# EAGLE design SD_A2 (EAGLE 9.2.2)
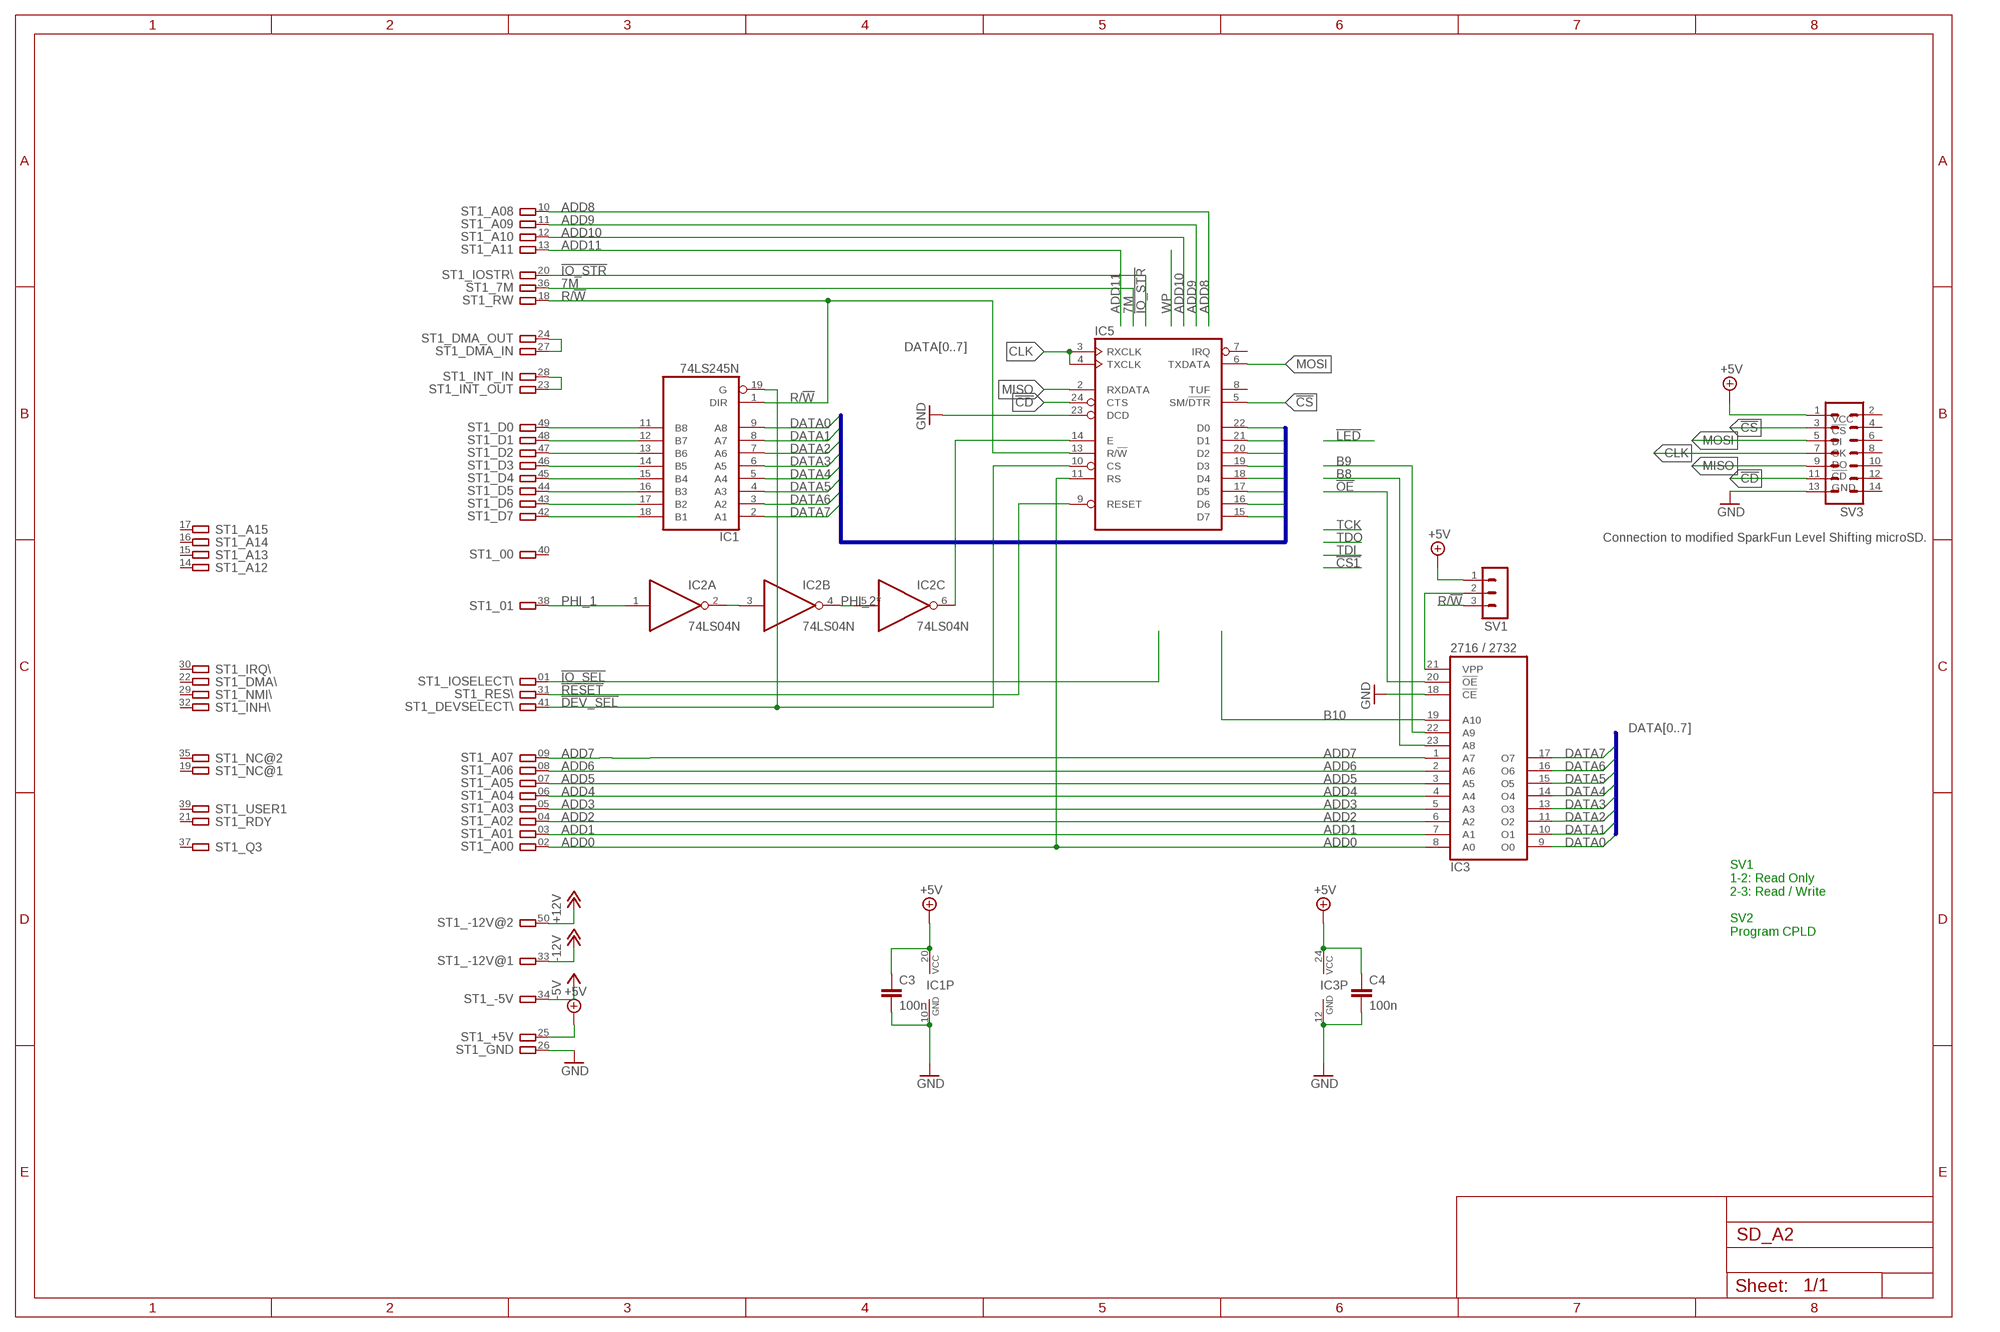
[diagram p0: schematic, sheet 1]

## Parts
C3  100n  C-EUC0603K  [C0603K]
C4  100n  C-EUC0603K  [C0603K]
IC1  74LS245N  [DIL20]
IC2  74LS04N  [DIL14]
IC3  2716 / 2732  2716  [DIL24]
IC5  6852  [DIL24]
ST1  A2-50PINSLOT1-3  [A2-50PIN-SL1-3]
SV1  MA03-1  [MA03-1]
SV3  MA07-2  [MA07-2]

## Nets
7M: ST1.36
!CD: IC5.24(CTS) SV3.11
!CS: IC5.5(SM/!DTR) SV3.3
!DEV_SEL: IC1.19(G) IC5.10(CS) ST1.41
!IO_SEL: ST1.01
!IO_STR: ST1.20
!OE: IC3.20(!OE)
!RESET: IC5.9(RESET) ST1.31
+5V: C3.1 C4.1 IC1.20(VCC) IC3.24(VCC) ST1.25 SV1.1 SV3.1
+12V: ST1.50
-5V: ST1.34
-12V: ST1.33
ADD0: IC3.8(A0) IC5.11(RS) ST1.02
ADD1: IC3.7(A1) ST1.03
ADD2: IC3.6(A2) ST1.04
ADD3: IC3.5(A3) ST1.05
ADD4: IC3.4(A4) ST1.06
ADD5: IC3.3(A5) ST1.07
ADD6: IC3.2(A6) ST1.08
ADD7: IC3.1(A7) ST1.09
ADD8: ST1.10
ADD9: ST1.11
ADD10: ST1.12
ADD11: ST1.13
B8: IC3.23(A8)
B9: IC3.22(A9)
B10: IC3.19(A10)
CLK: IC5.3(RXCLK) IC5.4(TXCLK) SV3.7
DATA0: IC1.9(A8) IC3.9(O0) IC5.22(D0)
DATA1: IC1.8(A7) IC3.10(O1) IC5.21(D1)
DATA2: IC1.7(A6) IC3.11(O2) IC5.20(D2)
DATA3: IC1.6(A5) IC3.13(O3) IC5.19(D3)
DATA4: IC1.5(A4) IC3.14(O4) IC5.18(D4)
DATA5: IC1.4(A3) IC3.15(O5) IC5.17(D5)
DATA6: IC1.3(A2) IC3.16(O6) IC5.16(D6)
DATA7: IC1.2(A1) IC3.17(O7) IC5.15(D7)
GND: C3.2 C4.2 IC1.10(GND) IC3.12(GND) IC3.18(!CE) IC5.23(DCD) ST1.26 SV3.13
MISO: IC5.2(RXDATA) SV3.9
MOSI: IC5.6(TXDATA) SV3.5
N$1: IC2.2(A:O) IC2.3(B:I)
N$2: IC2.4(B:O) IC2.5(C:I)
N$5: ST1.24 ST1.27
N$6: ST1.23 ST1.28
N$7: IC1.11(B8) ST1.49
N$8: IC1.18(B1) ST1.42
N$10: IC1.17(B2) ST1.43
N$11: IC1.16(B3) ST1.44
N$14: IC1.15(B4) ST1.45
N$15: IC1.14(B5) ST1.46
N$16: IC1.13(B6) ST1.47
N$17: IC1.12(B7) ST1.48
PHI_1: IC2.1(A:I) ST1.38
PHI_2*: IC2.6(C:O) IC5.14(E)
R/!W: IC1.1(DIR) IC5.13(R/!W) ST1.18 SV1.3
VPP: IC3.21(VPP) SV1.2
Unconnected: IC2.8(D:O) IC2.9(D:I) IC2.10(E:O) IC2.11(E:I) IC2.12(F:O) IC2.13(F:I) IC5.7(IRQ) IC5.8(TUF) ST1.14 ST1.15 ST1.16 ST1.17 ST1.19 ST1.21 ST1.22 ST1.29 ST1.30 ST1.32 ST1.35 ST1.37 ST1.39 ST1.40 SV3.2 SV3.4 SV3.6 SV3.8 SV3.10 SV3.12 SV3.14

## Buses
DATA[0..7]

## Notes on the sheet
- VCC
  !CS
  DI
  CK
  DO
  !CD
  GND
- Connection to modified SparkFun Level Shifting microSD.
- SV1
  1-2: Read Only
  2-3: Read / Write
  
  SV2
  Program CPLD

## Power pins joined to a net without a drawn wire
GND: IC2.7(P:GND)
VCC: IC2.14(P:VCC) IC5.12(VCC)
VSS: IC5.1(VSS)

## Library data of the parts
C3 C4 = rcl:C-EU: CAPACITOR, European symbol
IC1 = 74xx-eu:74*245: Octal BUS TRANSCEIVER, 3-state
IC2 = 74xx-us:74*04: Hex INVERTER
IC3 = memory:2716: MEMORY
IC5 = micro-motorola:6852: MICROCONTROLLER/MEMORY DEVICE; OC_FARNELL: unknown; OC_NEWARK: unknown
ST1 = con-apple2:A2-50PIN: Apple ][ Peripheral Card Connector This is the, default, 50-pin connector for slot #1 to #7 Pins are laid out as seen from the top of the slot
SV1 = con-lstb:MA03-1: PIN HEADER; OC_FARNELL: unknown; OC_NEWARK: unknown
SV3 = con-lstb:MA07-2: PIN HEADER; OC_FARNELL: unknown; OC_NEWARK: unknown

## Board
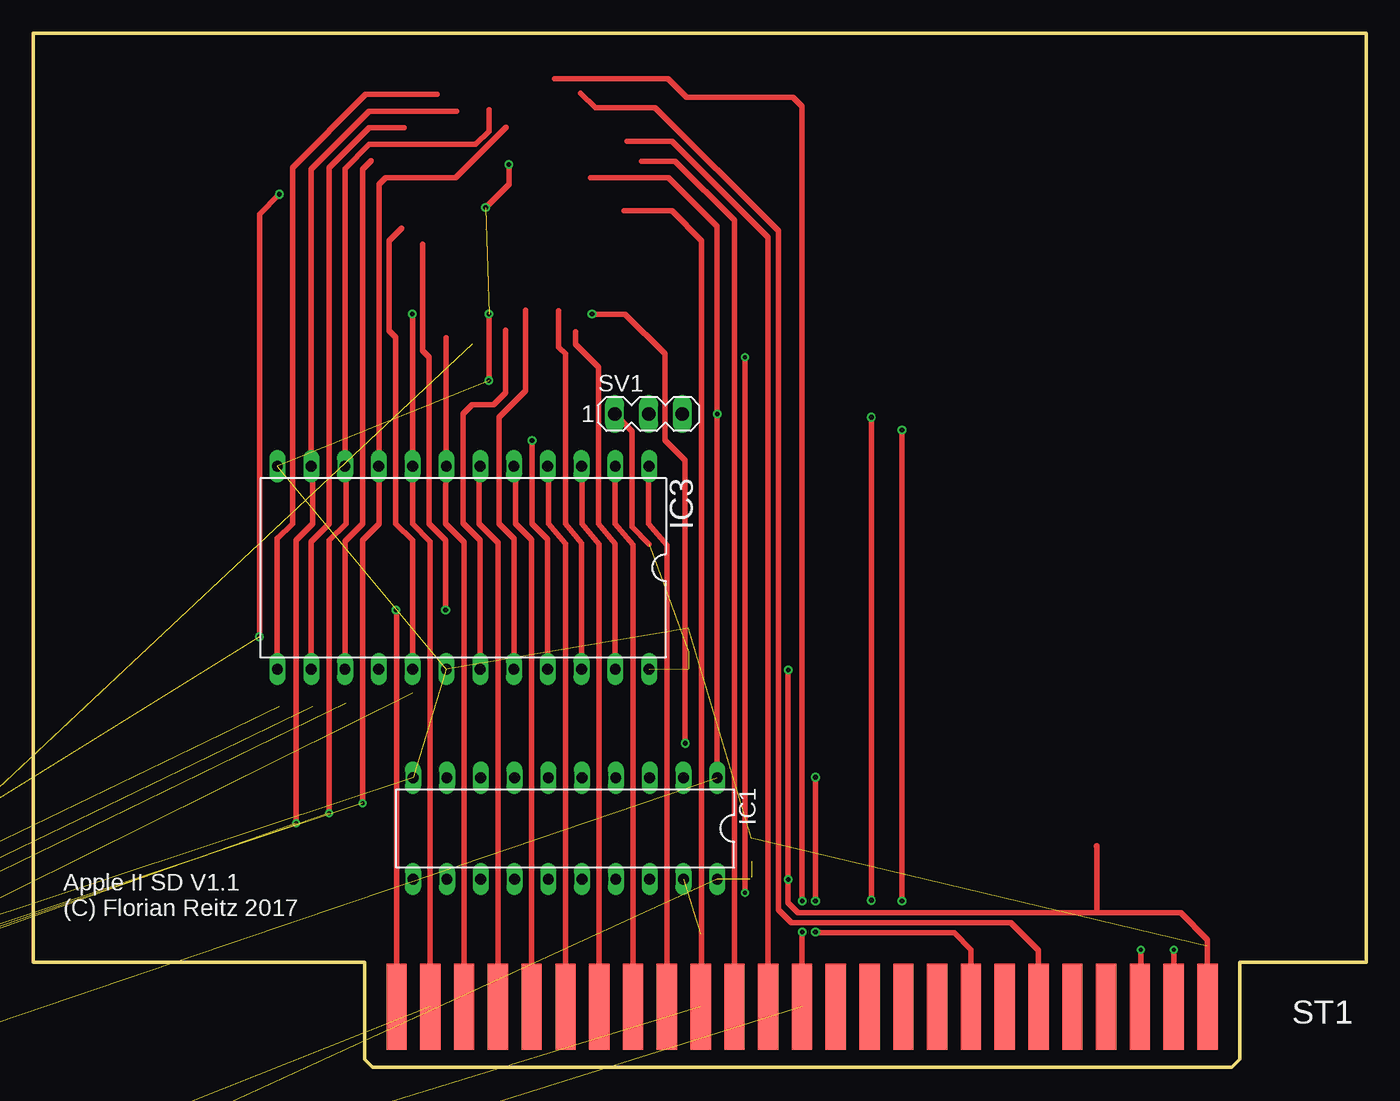
[diagram p1: board, top side]
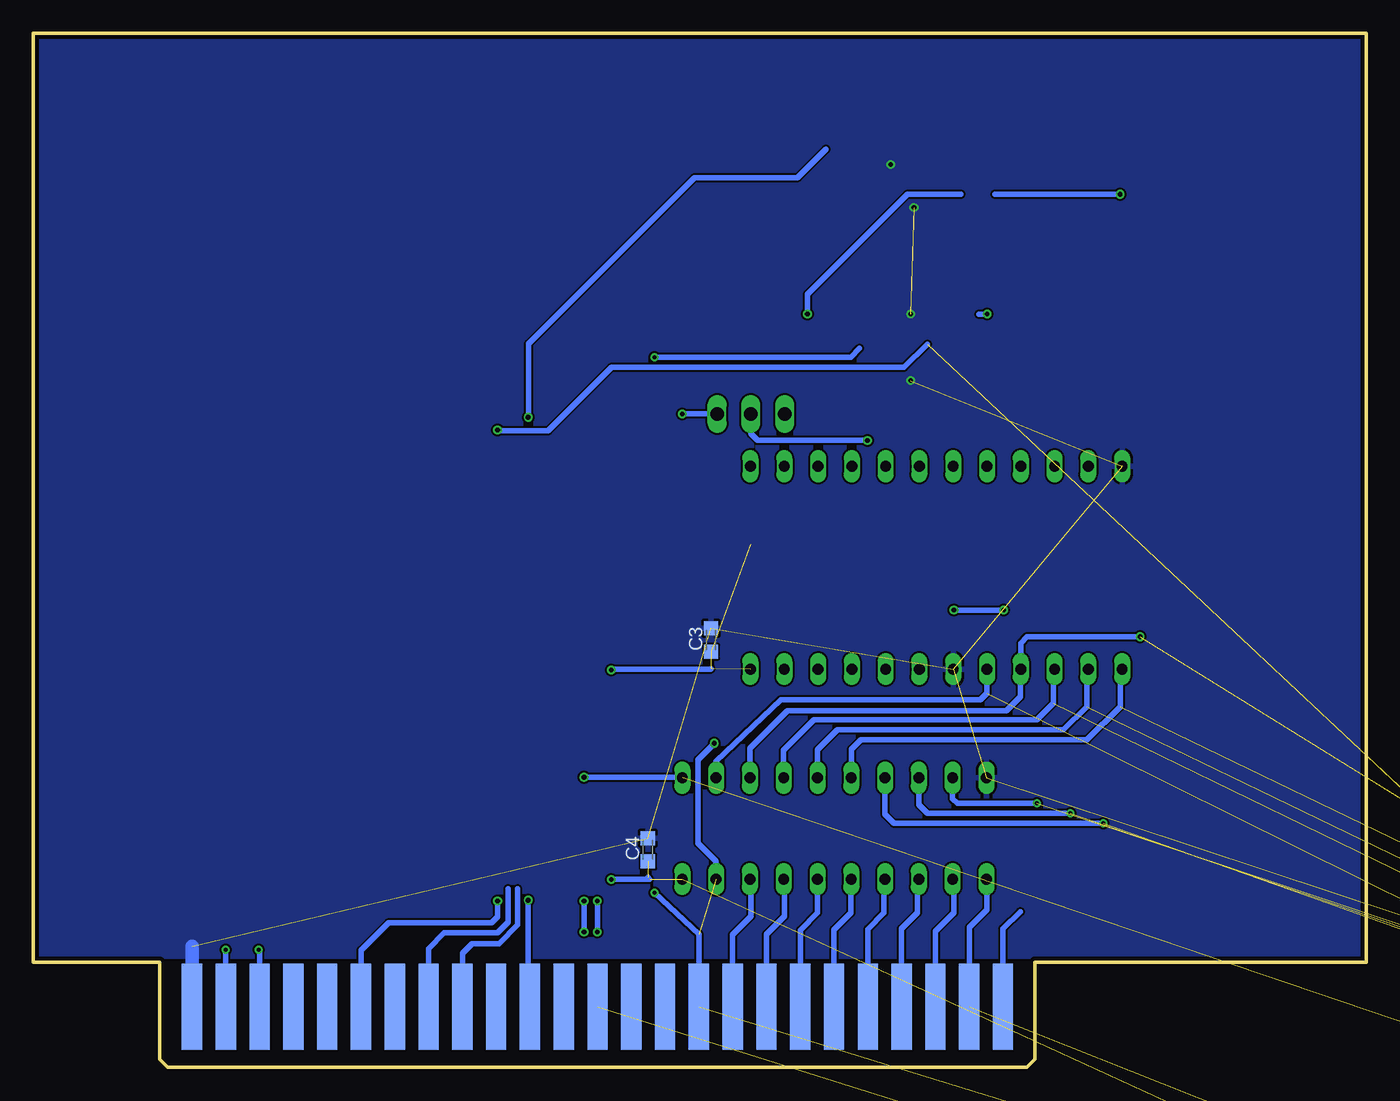
[diagram p2: board, bottom side, seen from below]

Size 100.2 x 77.7 mm. Coordinates in mm from the lower left corner, seen from the top.
Outline: 0,7.9 24.9,7.9 24.9,0.6 25.5,0 90.1,0 90.7,0.6 90.7,7.9 100.2,7.9 100.2,77.7 0,77.7 0,7.9
Copper layers (1*16): Top 0.035mm / dielectric 1.5mm / Bottom 0.035mm
Design rules "PCB-POOL Standard": minimum track width 0.15mm, minimum drill 0.3mm, track to track 0.15mm, track to pad 0.15mm, pad to pad 0.15mm, via to via 0.15mm, smd to smd 0.15mm, copper to edge 0.3mm, drill to drill 0.2mm, minimum pad ring 0.2mm, minimum via ring 0.15mm, stop-mask expansion 0.075mm, vias tented up to drill 0mil, thermal gap 0.2mm

### Footprints (pad centres in the part's own frame; a part is rotated, then mirrored left to right if it is on the bottom)
C0603K = smd 1.05 x 1.08: 1 -0.875,0; 2 0.875,0
DIL20 = drill 0.813 long: 1 -11.43,-3.81; 2 -8.89,-3.81; 3 -6.35,-3.81; 4 -3.81,-3.81; 5 -1.27,-3.81; 6 1.27,-3.81; 7 3.81,-3.81; 8 6.35,-3.81; 9 8.89,-3.81; 10 11.43,-3.81; 11 11.43,3.81; 12 8.89,3.81; 13 6.35,3.81; 14 3.81,3.81; 15 1.27,3.81; 16 -1.27,3.81; 17 -3.81,3.81; 18 -6.35,3.81; 19 -8.89,3.81; 20 -11.43,3.81
DIL14 = drill 0.813 long: 1 -7.62,-3.81; 2 -5.08,-3.81; 3 -2.54,-3.81; 4 0,-3.81; 5 2.54,-3.81; 6 5.08,-3.81; 7 7.62,-3.81; 8 7.62,3.81; 9 5.08,3.81; 10 2.54,3.81; 11 0,3.81; 12 -2.54,3.81; 13 -5.08,3.81; 14 -7.62,3.81
DIL24 = drill 0.813 long: 1 -13.97,-7.62; 2 -11.43,-7.62; 3 -8.89,-7.62; 4 -6.35,-7.62; 5 -3.81,-7.62; 6 -1.27,-7.62; 7 1.27,-7.62; 8 3.81,-7.62; 9 6.35,-7.62; 10 8.89,-7.62; 11 11.43,-7.62; 12 13.97,-7.62; 13 13.97,7.62; 14 11.43,7.62; 15 8.89,7.62; 16 6.35,7.62; 17 3.81,7.62; 18 1.27,7.62; 19 -1.27,7.62; 20 -3.81,7.62; 21 -6.35,7.62; 22 -8.89,7.62; 23 -11.43,7.62; 24 -13.97,7.62
A2-50PIN-SL1-3 = smd 1.524 x 6.477: 01 -73.025,4.445; 02 -70.485,4.445; 03 -67.945,4.445; 04 -65.405,4.445; 05 -62.865,4.445; 06 -60.325,4.445; 07 -57.785,4.445; 08 -55.245,4.445; 09 -52.705,4.445; 10 -50.165,4.445; 11 -47.625,4.445; 12 -45.085,4.445; 13 -42.545,4.445; 14 -40.005,4.445; 15 -37.465,4.445; 16 -34.925,4.445; 17 -32.385,4.445; 18 -29.845,4.445; 19 -27.305,4.445; 20 -24.765,4.445; 21 -22.225,4.445; 22 -19.685,4.445; 23 -17.145,4.445; 24 -14.605,4.445; 25 -12.065,4.445 | smd 1.524 x 6.477 bottom: 26 -12.065,4.445; 27 -14.605,4.445; 28 -17.145,4.445; 29 -19.685,4.445; 30 -22.225,4.445; 31 -24.765,4.445; 32 -27.305,4.445; 33 -29.845,4.445; 34 -32.385,4.445; 35 -34.925,4.445; 36 -37.465,4.445; 37 -40.005,4.445; 38 -42.545,4.445; 39 -45.085,4.445; 40 -47.625,4.445; 41 -50.165,4.445; 42 -52.705,4.445; 43 -55.245,4.445; 44 -57.785,4.445; 45 -60.325,4.445; 46 -62.865,4.445; 47 -65.405,4.445; 48 -67.945,4.445; 49 -70.485,4.445; 50 -73.025,4.445
MA03-1 = drill 1.016 long: 1 -2.54,0; 2 0,0; 3 2.54,0
MA07-2 = drill 1.016 octagon: 1 -7.62,-1.27; 2 -7.62,1.27; 3 -5.08,-1.27; 4 -5.08,1.27; 5 -2.54,-1.27; 6 -2.54,1.27; 7 0,-1.27; 8 0,1.27; 9 2.54,-1.27; 10 2.54,1.27; 11 5.08,-1.27; 12 5.08,1.27; 13 7.62,-1.27; 14 7.62,1.27

### Placement (x,y rotation side)
C3  49.25,32.1 90 bottom
C4  54,16.35 90 bottom
IC1  39.98,17.95 180 top
IC2  -66.5,-33 0 top  (outside the outline)
IC3  32.32,37.54 180 top
IC5  -59.6,-18.8 0 top  (outside the outline)
ST1  100.33,0.1 0 top
SV1  46.25,49.1 0 top
SV3  -68.3,-43 0 top  (outside the outline)

### Tracks (layer width: path | path; a pad name or v marks a point on that pad's centre or on a via)
7M  (via drill 0.35)
  Top 0.4: v63,48.85 v63,12.55
  Bottom 0.4: 62.97,4.64 ST1.36 63,4.68 v63,12.55 | 40.62,68.98 42.75,66.85 50.5,66.85 62.97,54.38 62.97,48.88 v63,48.85
!CD  (1 unrouted)
!CS  (1 unrouted)
!DEV_SEL  (via drill 0.3 pad 0.6, 0.35)  (2 unrouted)
  Top 0.4: v53.5,13.1 v53.5,53.35 | v49,24.35 49,45.6 47.5,47.1 47.5,53.6 44.5,56.6 v42,56.6
  Bottom 0.4: v53.5,13.1 50.16,10.01 ST1.41 | 38.08,54.02 38.75,53.35 v53.5,53.35 | IC1.19 48.87,15.47 50.25,16.85 50.25,23.1 v49,24.35 | v42,56.6 42,58.1 34.5,65.6 30.48,65.6
!IO_SEL  (via drill 0.35)
  Top 0.4: ST1.01 27.3,34.3 v27.25,34.35 | v31,34.35 31,39.6 29.75,40.85 29.75,53.35 29.25,53.85 29.25,61.83
  Bottom 0.4: v27.25,34.35 v31,34.35
!IO_STR
  Top 0.4: ST1.20 75.56,8.79 73.5,10.85 57,10.85 56,11.85 56,62.85 46.75,72.1 42.25,72.1 41.15,73.2
!OE
  Top 0.4: 37,56.88 37,50.85 35,48.85 35,40.85 36.13,39.72 IC3.20
!RESET  (via drill 0.35)  (1 unrouted)
  Top 0.4: v65.3,12.5 v65.3,47.9
  Bottom 0.4: 33,54.35 34.75,52.6 56.75,52.6 61.5,47.85 65.25,47.85 v65.3,47.9 | ST1.31 75.56,8.79 73.5,10.85 65.75,10.85 65.3,11.3 v65.3,12.5
+5V  (via drill 0.35)  (6 unrouted)
  Top 0.4: 46.29,39.31 45,40.6 45,47.81 SV1.1 | ST1.25 88.27,9.58 86.25,11.6 79.95,11.6 | v56.75,29.85 v56.75,14.1 56.75,12.35 57.5,11.6 79.95,11.6 | 79.93,16.6 79.96,16.63 79.96,14.33 | 79.96,14.33 79.96,11.61 79.95,11.6 | 79.94,14.35 79.96,14.33
  Bottom 0.4: v56.75,14.1 56.71,14.14 53.86,14.14 54,14.28 | v56.75,29.85 56.68,29.92 49.29,29.92 49.25,29.96
+12V
  Bottom 0.4: ST1.50 27.3,10.39 26,11.7
-5V
  Bottom 0.4: ST1.34 67.94,8.55 67.2,9.3 65.2,9.3 63.8,10.7 63.8,13.42
-12V
  Bottom 0.4: ST1.33 70.48,8.91 69.3,10.1 65.3,10.1 64.5,10.9 64.5,13.42
ADD0  (via drill 0.35)  (1 unrouted)
  Top 0.4: ST1.02 29.84,39.51 28.5,40.85 28.5,42.65 IC3.8 v28.51,56.59 v28.5,56.6
  Bottom 0.4: v28.5,56.6 29.1,56.6
ADD1
  Top 0.4: ST1.03 32.38,39.47 31,40.85 31,42.61 IC3.7 31.05,54.83
ADD2
  Top 0.4: IC3.6 33.5,45.07 33.5,40.85 34.92,39.43 ST1.04
ADD3
  Top 0.4: IC3.5 36.25,45.04 36.25,40.85 37.47,39.63 ST1.05
ADD4
  Top 0.4: IC3.4 38.75,45.08 38.75,40.85 40.01,39.34 ST1.06
ADD5
  Top 0.4: IC3.3 41.25,45.12 41.25,40.85 42.55,39.3 ST1.07
ADD6
  Top 0.4: IC3.2 43.75,40.85 45.09,39.27 ST1.08
ADD7
  Top 0.4: IC3.1 46.25,45.12 46.25,40.85 47.62,39.23 ST1.09
ADD8
  Top 0.4: ST1.10 50.25,4.63 50.25,62.1 48,64.35 44.39,64.35
ADD9
  Top 0.4: 45.72,68.1 48.25,68.1 52.7,63.65 ST1.11
ADD10
  Top 0.4: 44.64,69.6 48,69.6 50.62,66.97 55.24,62.36 ST1.12
ADD11  (via drill 0.35)
  Top 0.4: ST1.13 57.78,10.16 v57.8,10.17 | 39.18,74.3 47.7,74.3 49.1,72.9 57.1,72.9 57.8,72.2 v57.8,12.5
  Bottom 0.4: v57.8,10.17 v57.8,12.5
B8
  Top 0.4: IC3.23 43.75,39.35 42.5,40.85 42.5,52.6 40.75,54.35 40.75,55.29
B9
  Top 0.4: IC3.22 41.21,39.39 40,40.85 40,53.6 39.5,54.1 39.5,56.84
B10
  Top 0.4: 35.5,55.38 35.5,50.7 34.6,49.8 33,49.8 32.3,49.1 32.3,40.9 33.59,39.61 IC3.19
CLK  (2 unrouted)
DATA0  (via drill 0.3 pad 0.6)  (1 unrouted)
  Top 0.4: v24.75,19.85 24.75,39.6 26,40.85 26,45.13 IC3.9 26,45.19 26,66.35 26.5,66.85 31.75,66.85 35.54,70.64
  Bottom 0.4: v24.75,19.85 30.75,19.85 31.09,20.19 IC1.9
DATA1  (via drill 0.3 pad 0.6)  (1 unrouted)
  Top 0.4: v22.25,19.1 22.25,39.6 23.5,40.85 23.5,45.09 IC3.10 23.43,67.53 25.25,69.35 33.25,69.35 34.25,70.35 34.25,71.95
  Bottom 0.4: v22.25,19.1 33,19.1 33.63,19.73 IC1.8
DATA2  (via drill 0.3 pad 0.6)  (1 unrouted)
  Top 0.4: v19.75,18.35 19.75,39.6 21,40.85 21,45.05 IC3.11 20.89,67.49 25.25,71.85 31.81,71.85
  Bottom 0.4: v19.75,18.35 35.5,18.35 36.17,19.02 IC1.7
DATA3  (1 unrouted)
  Top 0.4: IC3.13 18.35,39.7 | 18.35,39.7 19.5,40.85 19.5,67.6 25,73.1 30.36,73.1 | 18.35,39.7 18.35,39.75
  Bottom 0.4: IC3.13 18.5,29.77 18.5,27.1 21,24.6 38,24.6 38.71,23.89 IC1.6
DATA4  (1 unrouted)
  Top 0.4: IC3.14 20.89,39.49 22.25,40.85 22.25,67.6 25.25,70.6 27.86,70.6
  Bottom 0.4: IC3.14 21,29.81 21,27.1 22.75,25.35 39.75,25.35 41.25,23.85 IC1.5
DATA5  (1 unrouted)
  Top 0.4: IC3.15 23.43,39.53 24.75,40.85 24.75,67.49 25.38,68.12
  Bottom 0.4: IC3.15 23.5,29.85 23.5,27.35 24.75,26.1 41.5,26.1 43.79,23.81 IC1.4
DATA6  (via drill 0.35)  (1 unrouted)
  Top 0.4: v17,32.35 17,64.1 v18.5,65.6
  Bottom 0.4: IC1.3 46.33,23.97 43.5,26.8 27.05,26.8 26,27.85 26,29.89 IC3.16 25.97,31.88 25.5,32.35 v17,32.35 | v18.5,65.6 27.9,65.6
DATA7  (1 unrouted)
  Top 0.4: IC3.17 28.51,39.59 27.25,40.85 27.25,54.85 26.75,55.35 26.75,62.1 27.69,63.04
  Bottom 0.4: IC3.17 28.5,28.1 29,27.6 44,27.6 48.87,22.98 IC1.2
GND  (via drill 0.35)  (10 unrouted)
  Top 0.4: v35.75,67.85 35.75,66.35 v34,64.6 | v34.25,51.6 v34.25,56.6
  Bottom 0.4: 88.27,9.08 88.25,9.1
  Bottom 1: ST1.26 88.27,9.08
  pour Bottom: 0.5,77.35 99.75,77.35 99.75,8.35 0.5,8.35
MISO  (1 unrouted)
MOSI  (1 unrouted)
N$1  (1 unrouted)
N$2  (1 unrouted)
N$5  (via drill 0.3 pad 0.6)
  Top 0.4: ST1.27 85.72,8.82 v85.75,8.85
  Bottom 0.4: v85.75,8.85 85.75,4.57 ST1.27
N$6  (via drill 0.3 pad 0.6)
  Top 0.4: v83.25,8.85 83.25,4.61 ST1.23
  Bottom 0.4: ST1.23 83.19,8.79 v83.25,8.85
N$7
  Bottom 0.4: ST1.49 29.84,10.5 28.5,11.85 28.5,14.09 IC1.11
N$8
  Bottom 0.4: ST1.42 47.62,9.97 46.25,11.35 46.25,14.06 IC1.18
N$10
  Bottom 0.4: ST1.43 45.09,10.01 43.75,11.35 43.75,14.1 IC1.17
N$11
  Bottom 0.4: ST1.44 42.55,10.3 41.25,11.6 IC1.16
N$14
  Bottom 0.4: ST1.45 40.01,10.34 38.75,11.6 38.75,14.1 IC1.15
N$15
  Bottom 0.4: ST1.46 37.47,10.38 36.25,11.6 36.25,14.06 IC1.14
N$16
  Bottom 0.4: ST1.47 34.92,10.42 33.75,11.6 33.75,14.02 IC1.13
N$17
  Bottom 0.4: ST1.48 32.38,10.21 31,11.6 31,14.05 IC1.12
PHI_1  (1 unrouted)
PHI_2*  (1 unrouted)
R/!W  (via drill 0.35)  (1 unrouted)
  Top 0.4: IC1.1 v51.41,49.1 51.41,63.19 47.75,66.85 41.89,66.85 | ST1.18 70.5,4.56 70.5,8.85 69.25,10.1 58.88,10.1 v58.8,10.17 | v58.8,12.5 v58.8,21.8
  Bottom 0.4: SV1.3 v51.41,49.1 | 51.5,21.85 IC1.1 51.45,21.8 v58.8,21.8 | v58.8,10.17 v58.8,12.5
VCC  (1 unrouted)
VPP  (via drill 0.35)
  Top 0.4: IC3.21 38.67,39.68 37.5,40.85 v37.5,47.1
  Bottom 0.4: SV1.2 46.25,47.6 45.75,47.1 v37.5,47.1

### Text on the board
tNames: Apple II SD V1.1 / (C) Florian Reitz 2017